# Altium schematic sheet MODULE_PWR.SchDoc: MODULE PWR
size A3; Author: Silvio Navaretti; CompanyName: ARDUINO; DrawnBy: Silvio Navaretti; Engineer: Silvio Navaretti; Organization: ARDUINO; SheetNumber: 9; SheetTotal: 51; RevAuthor: Silvio Navaretti
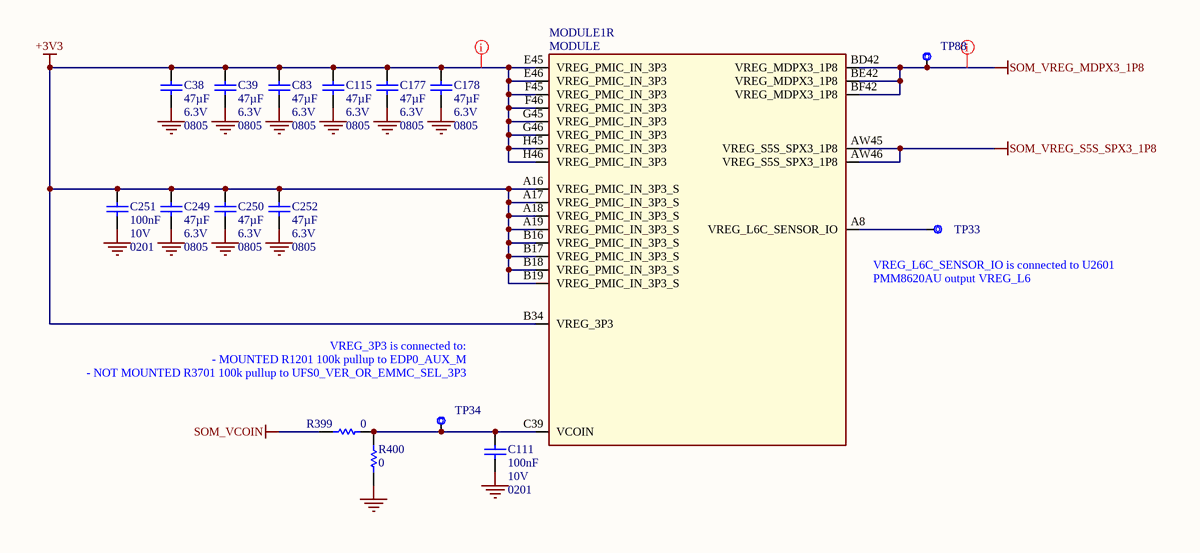
[diagram p0: MODULE_PWR.SchDoc]

## Parts
C38  value 47µF  Voltage: 6.3V  Case Code (Imperial): 0805  [CAP-0805]  (hidden comment: C0805C476M9PAC7800)
C39  value 47µF  Voltage: 6.3V  Case Code (Imperial): 0805  [CAP-0805]  (hidden comment: C0805C476M9PAC7800)
C83  value 47µF  Voltage: 6.3V  Case Code (Imperial): 0805  [CAP-0805]  (hidden comment: C0805C476M9PAC7800)
C111  value 100nF  Voltage: 10V  Case Code (Imperial): 0201  [CAP-0201]  (hidden comment: CL03A104KP3NNNC)
C115  value 47µF  Voltage: 6.3V  Case Code (Imperial): 0805  [CAP-0805]  (hidden comment: C0805C476M9PAC7800)
C177  value 47µF  Voltage: 6.3V  Case Code (Imperial): 0805  [CAP-0805]  (hidden comment: C0805C476M9PAC7800)
C178  value 47µF  Voltage: 6.3V  Case Code (Imperial): 0805  [CAP-0805]  (hidden comment: C0805C476M9PAC7800)
C249  value 47µF  Voltage: 6.3V  Case Code (Imperial): 0805  [CAP-0805]  (hidden comment: C0805C476M9PAC7800)
C250  value 47µF  Voltage: 6.3V  Case Code (Imperial): 0805  [CAP-0805]  (hidden comment: C0805C476M9PAC7800)
C251  value 100nF  Voltage: 10V  Case Code (Imperial): 0201  [CAP-0201]  (hidden comment: CL03A104KP3NNNC)
C252  value 47µF  Voltage: 6.3V  Case Code (Imperial): 0805  [CAP-0805]  (hidden comment: C0805C476M9PAC7800)
MODULE1  MODULE  [MODULE]  (part R of 22)
R399  value 0  [RES-0201]  (hidden comment: CRCW02010000Z0ED)
R400  value 0  [RES-0201]  (hidden comment: CRCW02010000Z0ED)
TP33  Test point 1.00mm  [TP-1.00MM]  (value not drawn)  (no BOM)
TP34  Test point 1.00mm  [TP-1.00MM]  (value not drawn)  (no BOM)
TP88  Test point 1.00mm  [TP-1.00MM]  (value not drawn)  (no BOM)

## Nets
+3V3: C38.2 C39.2 C83.2 C115.2 C177.2 C178.2 C249.2 C250.2 C251.2 C252.2 MODULE1.A16(VREG_PMIC_IN_3P3_S) MODULE1.A17(VREG_PMIC_IN_3P3_S) MODULE1.A18(VREG_PMIC_IN_3P3_S) MODULE1.A19(VREG_PMIC_IN_3P3_S) MODULE1.B16(VREG_PMIC_IN_3P3_S) MODULE1.B17(VREG_PMIC_IN_3P3_S) MODULE1.B18(VREG_PMIC_IN_3P3_S) MODULE1.B19(VREG_PMIC_IN_3P3_S) MODULE1.B34(VREG_3P3) MODULE1.E45(VREG_PMIC_IN_3P3) MODULE1.E46(VREG_PMIC_IN_3P3) MODULE1.F45(VREG_PMIC_IN_3P3) MODULE1.F46(VREG_PMIC_IN_3P3) MODULE1.G45(VREG_PMIC_IN_3P3) MODULE1.G46(VREG_PMIC_IN_3P3) MODULE1.H45(VREG_PMIC_IN_3P3) MODULE1.H46(VREG_PMIC_IN_3P3)
GND: C38.1 C39.1 C83.1 C111.1 C115.1 C177.1 C178.1 C249.1 C250.1 C251.1 C252.1 R400.1
SOM_VCOIN: R399.1
SOM_VREG_MDPX3_1P8: MODULE1.BD42(VREG_MDPX3_1P8) MODULE1.BE42(VREG_MDPX3_1P8) MODULE1.BF42(VREG_MDPX3_1P8) TP88.X
SOM_VREG_S5S_SPX3_1P8: MODULE1.AW45(VREG_S5S_SPX3_1P8) MODULE1.AW46(VREG_S5S_SPX3_1P8)
NetC111_2: C111.2 MODULE1.C39(VCOIN) R399.2 R400.2 TP34.X
NetMODULE1_A8: MODULE1.A8(VREG_L6C_SENSOR_IO) TP33.X

## Layout directives
net class NET_3V3: +3V3
net class NET_1V8_SOM: SOM_VREG_MDPX3_1P8

## Notes on the sheet
- VREG_L6C_SENSOR_IO is connected to U2601 PMM8620AU output VREG_L6
- VREG_3P3 is connected to:
  - MOUNTED R1201 100k pullup to EDP0_AUX_M
  - NOT MOUNTED R3701 100k pullup to UFS0_VER_OR_EMMC_SEL_3P3
- Title:
- ID:
- Date:
- Time:
- Version:
- Sheet
- of
- RevAuthor:
- Reference Designs ARE PROVIDED "AS IS" AND "WITH ALL FAULTS. Arduino SA DISCLAIMS ALL OTHER WARRANTIES, EXPRESS OR IMPLIED, REGARDING PRODUCTS, INCLUDING BUT NOT LIMITED TO, ANY IMPLIED WARRANTIES OF MERCHANTABILITY OR FITNESS FOR A PARTICULAR PURPOSE.
  Arduino SA may make changes to specifications and product descriptions at any time, without notice. The Customer must not rely on the absence or characteristics of any features or instructions marked "reserved" or "undefined".
  Arduino SA reserves these for future definition and shall have no responsibility whatsoever for conflicts or incompatibilities arising from future changes to them. The product information on the Web Site or Materials is subject to change without notice.
  Do not finalize a design with this info. ARDUINO and other Arduino brands and logos and Trademarks of Arduino SA. All Arduino SA Trademarks cannot be used without owner's formal permission.
- File:
- Author:

## Library data of the parts
C38 C39 C83 C115 C177 C178 C249 C250 C252 = C0199-A.1: CAP CHIP 0805 47uF 20% 6.3V X5R; Manufacturer: KEMET; Code Arduino: C0199; Part Number: C0805C476M9PAC7800; Tolerance: 20%; Dielectric: X5R; Technology: Ceramic
C111 C251 = C0113-A.6: CAP CHIP 0201 100nF 10% 10V X5R; Manufacturer: Samsung Electro-Mechanics; Code Arduino: C0113; Technology: Ceramic; Part Number: CL03A104KP3NNNC; Dielectric: X5R; Tolerance: 10%
MODULE1 = M0029-A.19: MODULE BGA 1883 balls 57.5x57.5mm; Manufacturer: Qualcomm; Code Arduino: M0029; Part Number: MODULE BGA; Pin Count: 1883
R399 R400 = R0140-A.21: RES CHIP 0201 0R; Manufacturer: Vishay; Temperature coefficient: 0ppm; Code Arduino: R0140; Power: 50mW; Tolerance: 0%; Technology: Thick film; Case Code (Imperial): 0201; Part Number: CRCW02010000Z0ED
TP33 TP34 TP88 = UT0013-A.6: Part Number: This is not a component; Design Item ID: CMP-018-0005-A.3; Source: ut.SchLib; Manufacturer: This is not a component; Code Arduino: This is not a component; Pin Count: 1